# EAGLE design power-board LED_V2 (EAGLE 6.6.0)
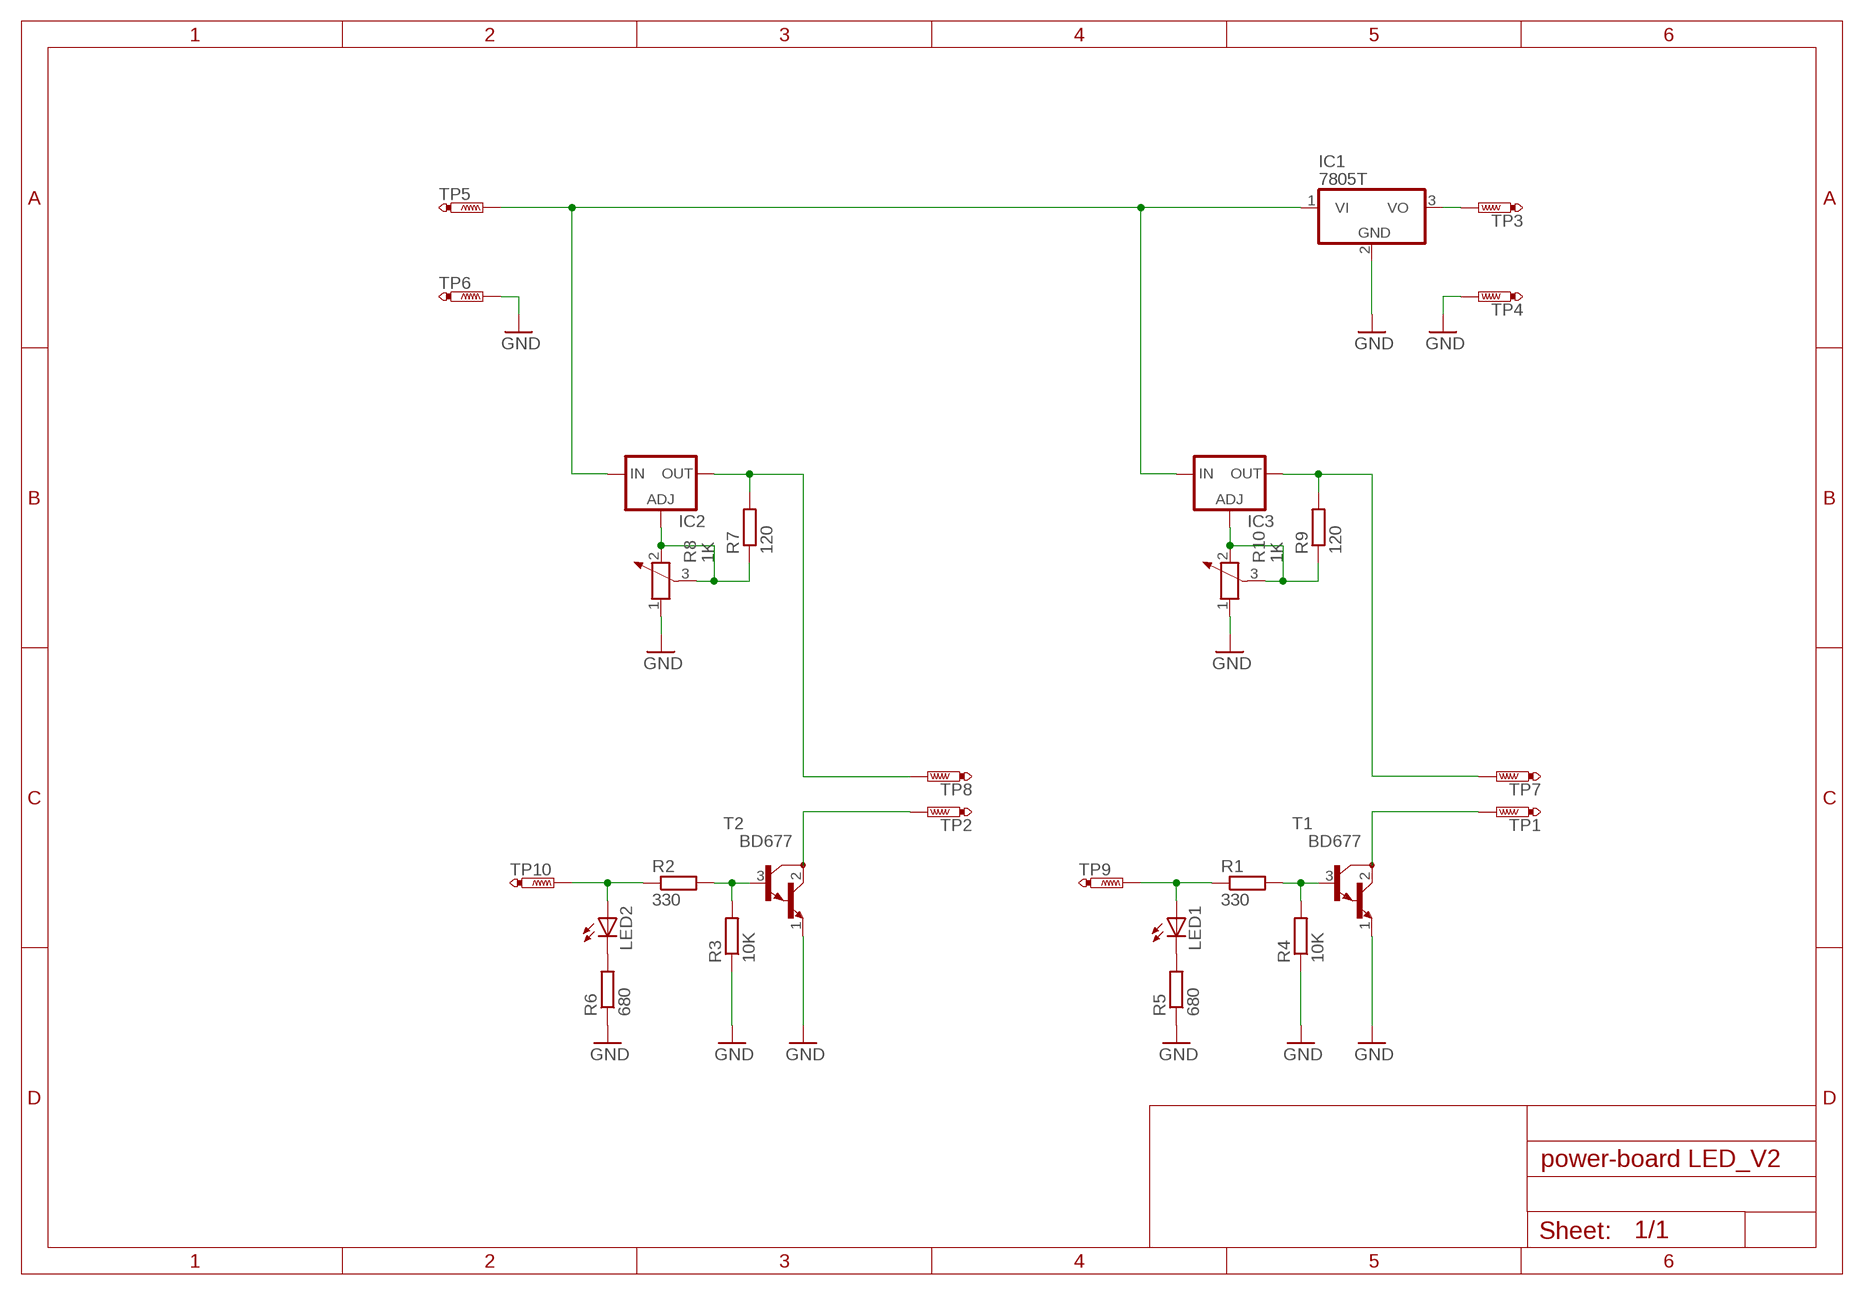
[diagram p0: schematic, sheet 1]

## Parts
IC1  7805T  [TO220H]
IC2  LM317TS  [317TS]
IC3  LM317TS  [317TS]
LED1  LED3MM  [LED3MM]
LED2  LED3MM  [LED3MM]
R1  330  R-EU_0207/10  [0207/10]
R2  330  R-EU_0207/10  [0207/10]
R3  10K  R-EU_0207/10  [0207/10]
R4  10K  R-EU_0207/10  [0207/10]
R5  680  R-EU_0207/10  [0207/10]
R6  680  R-EU_0207/10  [0207/10]
R7  120  R-EU_0207/10  [0207/10]
R8  1K  POTENTIOMETER_PT-10  [PT-10]
R9  120  R-EU_0207/10  [0207/10]
R10  1K  POTENTIOMETER_PT-10  [PT-10]
T1  BD677  [TO126]
T2  BD677  [TO126]
TP1  PTR1PAD1-17  [P1-17]
TP2  PTR1PAD1-17  [P1-17]
TP3  PTR1PAD1-17  [P1-17]
TP4  PTR1PAD1-17  [P1-17]
TP5  PTR1PAD1-17  [P1-17]
TP6  PTR1PAD1-17  [P1-17]
TP7  PTR1PAD1-17  [P1-17]
TP8  PTR1PAD1-17  [P1-17]
TP9  PTR1PAD1-17  [P1-17]
TP10  PTR1PAD1-17  [P1-17]

## Nets
GND: IC1.2(GND) R3.1 R4.1 R5.1 R6.1 R8.1 R10.1 T1.1(E) T2.1(E) TP4.TP TP6.TP
N$1: R1.2 R4.2 T1.3(B)
N$2: LED1.A R1.1 TP9.TP
N$3: T1.2(C) TP1.TP
N$4: R2.2 R3.2 T2.3(B)
N$5: LED2.A R2.1 TP10.TP
N$6: T2.2(C) TP2.TP
N$7: IC1.3(VO) TP3.TP
N$8: LED1.K(C) R5.2
N$10: LED2.K(C) R6.2
N$13: IC2.1(ADJ) R7.1 R8.2 R8.3
N$14: IC3.1(ADJ) R9.1 R10.2 R10.3
N$15: IC3.2(OUT) R9.2 TP7.TP
N$16: IC2.2(OUT) R7.2 TP8.TP
N$17: IC1.1(VI) IC2.3(IN) IC3.3(IN) TP5.TP

## Library data of the parts
IC1 = linear:78*: Positive VOLTAGE REGULATOR Source: http://cache.national.com/ds/LM/LM78L05.pdf http://www.fairchildsemi.com/ds/LM/LM7805.pdf
IC2 IC3 = v-reg:LM317TS: VOLTAGE REGULATOR
LED1 LED2 = led:LED: LED OSRAM: - CHIPLED LG R971, LG N971, LY N971, LG Q971, LY Q971, LO R971, LY R971 LH N974, LH R974 LS Q976, LO Q976, LY Q976 LO Q996 - Hyper CHIPLED LW Q18S LB Q993, LB Q99A, LB R99A - SideLED LS A670, LO A670, LY A670, LG A670, LP A670 LB A673, LV A673, LT A673, LW A673 LH A674 LY A675 LS A676, LA A676, LO A676, LY A676, LW A676 LS A679, LY A679, LG A679 - Hyper Micro SIDELED® LS Y876, LA Y876, LO Y876, LY Y876 LT Y87S - SmartLED LW L88C, LW L88S LB L89C, LB L89S, LG L890 LS L89K, LO L89K, LY L89K LS L896, LA L896, LO L896, LY L896 - TOPLED LS T670, LO T670, LY T670, LG T670, LP T670 LSG T670, LSP T670, LSY T670, LOP T670, LYG T670 LG T671, LOG T671, LSG T671 LB T673, LV T673, LT T673, LW T673 LH T674 LS T676, LA T676, LO T676, LY T676, LB T676, LH T676, LSB T676, LW T676 LB T67C, LV T67C, LT T67C, LS T67K, LO T67K, LY T67K, LW E67C LS E67B, LA E67B, LO E67B, LY E67B, LB E67C, LV E67C, LT E67C LW T67C LS T679, LY T679, LG T679 LS T770, LO T770, LY T770, LG T770, LP T770 LB T773, LV T773, LT T773, LW T773 LH T774 LS E675, LA E675, LY E675, LS T675 LS T776, LA T776, LO T776, LY T776, LB T776 LHGB T686 LT T68C, LB T68C - Hyper Mini TOPLED® LB M676 - Mini TOPLED Santana® LG M470 LS M47K, LO M47K, LY M47K Source: http://www.osram.convergy.de LUXEON: - LUMILED® LXK2-PW12-R00, LXK2-PW12-S00, LXK2-PW14-U00, LXK2-PW14-V00 LXK2-PM12-R00, LXK2-PM12-S00, LXK2-PM14-U00 LXK2-PE12-Q00, LXK2-PE12-R00, LXK2-PE12-S00, LXK2-PE14-T00, LXK2-PE14-U00 LXK2-PB12-K00, LXK2-PB12-L00, LXK2-PB12-M00, LXK2-PB14-N00, LXK2-PB14-P00, LXK2-PB14-Q00 LXK2-PR12-L00, LXK2-PR12-M00, LXK2-PR14-Q00, LXK2-PR14-R00 LXK2-PD12-Q00, LXK2-PD12-R00, LXK2-PD12-S00 LXK2-PH12-R00, LXK2-PH12-S00 LXK2-PL12-P00, LXK2-PL12-Q00, LXK2-PL12-R00 Source: www.luxeon.com KINGBRIGHT: KA-3528ASYC Source: www.kingbright.com
R1-R7 R9 = rcl:R-EU_: RESISTOR, European symbol
R8 R10 = rcl:POTENTIOMETER_: Potentiometer
T1 T2 = transistor:BD677: NPN BIPOLAR DARLINGTON TRANSISTOR
TP1-TP10 = testpad:PTR1: TEST PIN

## Board
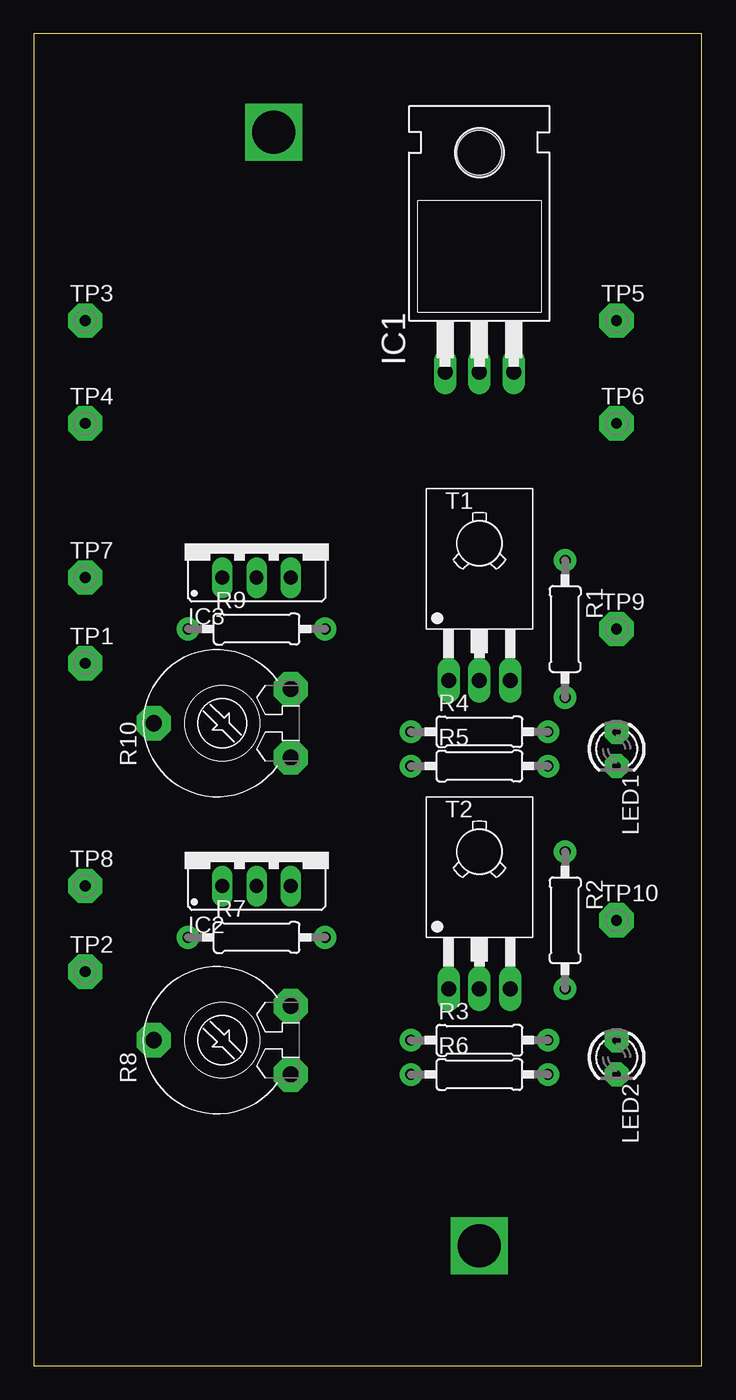
[diagram p1: board, top side]
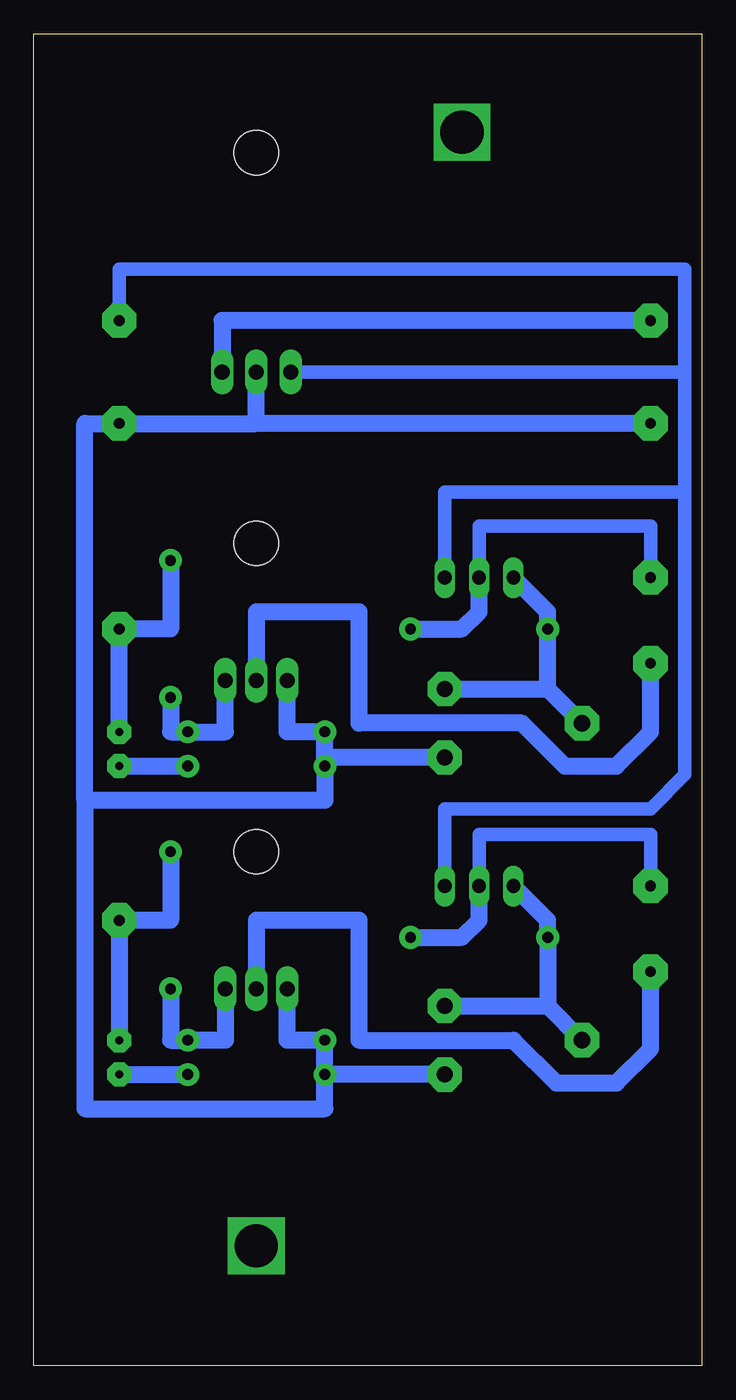
[diagram p2: board, bottom side, seen from below]

Size 49.51 x 98.73 mm. Coordinates in mm from the lower left corner, seen from the top.
Outline: 0,0 49.51,0 49.51,98.73 0,98.73 0,0
Copper layers (1*16): Top 0.035mm / dielectric 1.5mm / Bottom 0.035mm
Design rules "default": minimum track width 10mil, minimum drill 24mil, track to track 8mil, track to pad 8mil, pad to pad 8mil, via to via 8mil, smd to smd 8mil, copper to edge 40mil, drill to drill 8mil, minimum pad ring 10mil, minimum via ring 8mil, stop-mask expansion 4mil, vias tented up to drill 0mil, thermal gap 10mil

### Footprints (pad centres in the part's own frame; a part is rotated, then mirrored left to right if it is on the bottom)
TO220H = drill 1.118 long: 1 -2.54,-11.43; 2 0,-11.43; 3 2.54,-11.43 | hole 3.302: 0,4.826
317TS = drill 1.016 long: 1 -2.54,-2.54; 2 0,-2.54; 3 2.54,-2.54
LED3MM = drill 0.6 pad 1.778 octagon: A -1.27,0; K 1.27,0
0207/10 = drill 0.8 pad 1.676: 1 -5.08,0; 2 5.08,0
PT-10 = drill 1.2 pad 2.54 octagon: 1 -2.54,-5.08; 2 2.54,-5.08; 3 0,5.08
TO126 = drill 1.118 long: 1 -2.286,-5.08; 2 0,-5.08; 3 2.286,-5.08 | hole 3.302: 0,5.08
P1-17 = drill 0.8 pad 2.54 octagon: TP 0,0

### Placement (x,y rotation side)
IC1  33.02,85.09 0 top
IC2  16.51,38.1 0 top
IC3  16.51,60.96 0 top
LED1  43.18,45.72 270 top
LED2  43.18,22.86 270 top
R1  39.37,54.61 270 top
R2  39.37,33.02 270 top
R3  33.02,24.13 0 top
R4  33.02,46.99 0 top
R5  33.02,44.45 0 top
R6  33.02,21.59 0 top
R7  16.51,31.75 0 top
R8  13.97,24.13 90 top
R9  16.51,54.61 0 top
R10  13.97,47.62 90 top
T1  33.02,55.88 0 top
T2  33.02,33.02 0 top
TP1  3.81,52.07 0 top
TP2  3.81,29.21 0 top
TP3  3.81,77.47 0 top
TP4  3.81,69.85 0 top
TP5  43.18,77.47 0 top
TP6  43.18,69.85 0 top
TP7  3.81,58.42 0 top
TP8  3.81,35.56 0 top
TP9  43.18,54.61 0 top
TP10  43.18,33.02 0 top

### Tracks (layer width: path | path; a pad name or v marks a point on that pad's centre or on a via)
GND
  Bottom 1.27: TP4.TP 33.02,69.85 | 33.02,69.85 IC1.2 | 33.02,69.85 TP6.TP 45.72,69.85 45.72,41.91 | R5.1 R4.1 30.73,46.99 T1.1 | R6.1 R3.1 30.73,24.13 T2.1 | R5.1 27.94,41.91 45.72,41.91 | 45.72,41.91 45.72,19.05 27.94,19.05 R6.1 | R10.1 27.3,45.09 R5.1 | R8.1 R6.1
N$1
  Bottom 1.27: T1.3 35.31,46.99 R4.2 39.37,46.99 R1.2
N$2
  Bottom 1.27: LED1.A TP9.TP 39.37,54.61 R1.1
N$3
  Bottom 1.27: T1.2 33.02,55.88 25.4,55.88 25.4,47.62 13.34,47.62 10.16,44.45 6.35,44.45 3.81,46.99 TP1.TP
N$4
  Bottom 1.27: T2.3 35.31,24.13 R3.2 39.37,24.13 R2.2
N$5
  Bottom 1.27: R2.1 39.37,33.02 TP10.TP LED2.A
N$6
  Bottom 1.27: T2.2 33.02,33.02 25.4,33.02 25.4,24.13 13.97,24.13 10.79,20.95 6.35,20.95 3.81,23.5 TP2.TP
N$7
  Bottom 1.27: TP3.TP 35.56,77.47 IC1.3
N$8
  Bottom 1.27: LED1.K R5.2
N$10
  Bottom 1.27: LED2.K R6.2
N$11  (via drill 3.2)
  other vias: 17.78,91.44
N$12  (via drill 3.2)
  other vias: 33.02,8.89
N$13
  Bottom 1.27: R8.2 11.43,26.67 | 11.43,26.67 R8.3 | 11.43,26.67 R7.1 11.43,33.02 IC2.1
N$14
  Bottom 1.27: R10.2 11.43,50.16 | 11.43,50.16 R10.3 | 11.43,50.16 R9.1 11.43,55.88 IC3.1
N$15
  Bottom 1.016: IC3.2 16.51,62.23 3.81,62.23 TP7.TP
  Bottom 1.27: R9.2 17.78,54.61 16.51,55.88 IC3.2
N$16
  Bottom 1.016: IC2.2 16.51,39.37 3.81,39.37 TP8.TP
  Bottom 1.27: R7.2 17.78,31.75 16.51,33.02 IC2.2
N$17
  Bottom 1.016: IC2.3 19.05,41.27 3.81,41.27 1.27,43.81 1.27,64.77 | 1.27,64.77 19.05,64.77 IC3.3 | IC1.1 1.27,73.66 | 1.27,73.66 1.27,64.77 | TP5.TP 43.18,81.28 1.27,81.28 1.27,73.66